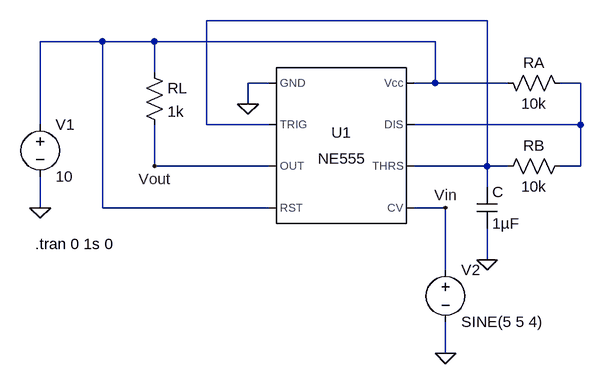
[diagram p0: schematic NE555-Voltage-Controlled-Pulse-Width-Modulation-Oscillator.asc]
NE555-Voltage-Controlled-Pulse-Width-Modulation-Oscillator.asc, the LTspice schematic file:
Version 4
SHEET 1 880 680
WIRE 416 -32 -16 -32
WIRE -176 0 -272 0
WIRE -96 0 -176 0
WIRE 336 0 -96 0
WIRE -96 48 -96 0
WIRE 80 64 48 64
WIRE 336 64 336 0
WIRE 336 64 304 64
WIRE 448 64 336 64
WIRE 560 64 528 64
WIRE 48 96 48 64
WIRE -272 128 -272 0
WIRE -16 128 -16 -32
WIRE 80 128 -16 128
WIRE 560 128 560 64
WIRE 560 128 304 128
WIRE -96 192 -96 128
WIRE 80 192 -96 192
WIRE 416 192 416 -32
WIRE 416 192 304 192
WIRE 448 192 416 192
WIRE 560 192 560 128
WIRE 560 192 528 192
WIRE 416 224 416 192
WIRE -272 256 -272 208
WIRE -176 256 -176 0
WIRE 80 256 -176 256
WIRE 352 256 304 256
WIRE 416 336 416 288
WIRE 352 352 352 256
WIRE 352 480 352 432
FLAG -272 256 0
FLAG 48 96 0
FLAG 416 336 0
FLAG 352 480 0
FLAG 352 256 Vin
FLAG -96 192 Vout
SYMBOL Misc\\NE555 192 160 R0
SYMATTR InstName U1
SYMBOL voltage -272 112 R0
WINDOW 123 0 0 Left 0
WINDOW 39 0 0 Left 0
SYMATTR InstName V1
SYMATTR Value 10
SYMBOL cap 400 224 R0
SYMATTR InstName C
SYMATTR Value 1µF
SYMBOL res 544 80 M270
WINDOW 0 32 56 VTop 2
WINDOW 3 0 56 VBottom 2
SYMATTR InstName RA
SYMATTR Value 10k
SYMBOL res -112 32 R0
SYMATTR InstName RL
SYMATTR Value 1k
SYMBOL voltage 352 336 R0
WINDOW 123 0 0 Left 0
WINDOW 39 0 0 Left 0
SYMATTR InstName V2
SYMATTR Value SINE(5 5 4)
SYMBOL res 544 176 R90
WINDOW 0 0 56 VBottom 2
WINDOW 3 32 56 VTop 2
SYMATTR InstName RB
SYMATTR Value 10k
TEXT -280 312 Left 2 !.tran 0 1s 0

The netlist it stands for:
* NE555-Voltage-Controlled-Pulse-Width-Modulation-Oscillator.asc
XU1 0 N001 Vout N002 Vin N001 N003 N002 NE555  ; pins GND TRIG OUT RST CV THRS DIS Vcc
V1 N002 0 10
C N001 0 1µF
RA N003 N002 10k
RL N002 Vout 1k
V2 Vin 0 SINE(5 5 4)
RB N003 N001 10k
.tran 0 1s 0
.lib NE555.sub
.backanno
.end